# Altium schematic sheet Sheet1.SchDoc
size A; SheetNumber: 1; SheetTotal: 1
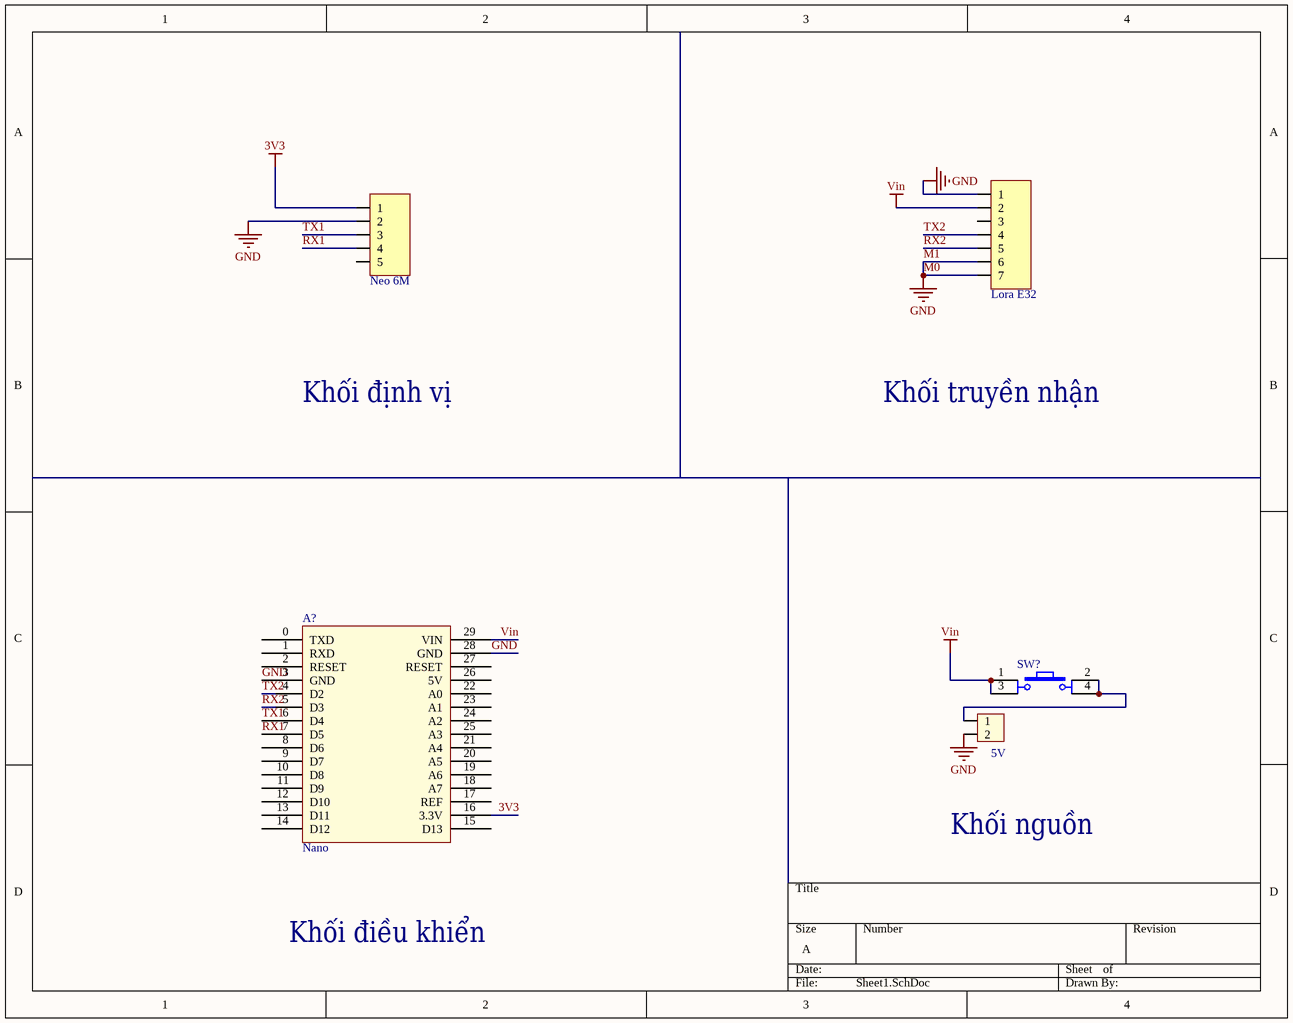
[diagram p0: Sheet1.SchDoc]

## Parts
(Parts that share a designator on the sheet are numbered #1, #2 ... from top to bottom, then left to right.)
5V  Header 2P 2.54 Duc Thang  [XH2.54M-2]  (value not drawn)
A?  Nano  [Arduino nano]
JP?#1  Lora E32  [JP 1x7 CT]
JP?#2  Neo 6M  [JP 1x5 CT]
SW?  INI PUSH BUTTON SWITCH 4-PIN  [SW_70_31.5D47_TH_ST]  (value not drawn)

## Nets
3V3: A?.16(3.3V) JP?#2.1
GND: 5V.2 A?.3(GND) A?.28(GND) JP?#1.1 JP?#1.6 JP?#1.7 JP?#2.2  [also labelled M0, M1]
Vin: A?.29(VIN) JP?#1.2 SW?.1 SW?.3
RX1: A?.7(D5) JP?#2.4
RX2: A?.5(D3) JP?#1.5
TX1: A?.6(D4) JP?#2.3
TX2: A?.4(D2) JP?#1.4
Net5V_1: 5V.1 SW?.2 SW?.4

Not connected (* = marked no-connect by the designer): A? 0(TXD) 1(RXD) 2(RESET) 8(D6) 9(D7) 10(D8) 11(D9) 12(D10) 13(D11) 14(D12) 15(D13) 17(REF) 18(A7) 19(A6) 20(A5) 21(A4) 22(A0) 23(A1) 24(A2) 25(A3) 26(5V) 27(RESET); JP?#1 3; JP?#2 5

## Notes on the sheet
- Khối định vị
- Khối truyền nhận
- Khối nguồn
- Khối điều khiển

## Library data of the parts
5V = Header 2P 2.54 Duc Thang: Cắm; Ten_Linh_Kien: Header 2P XH2.54-2P Đực Thẳng; Don_Vi: Con; Ma_Hang: MH001283; Chung_Loai: Cắm
A? = Arduino Nano
JP?#1 = JP 1x7 2.54 Cai Thang: Cắm; Ten_Linh_Kien: Jump Đơn Cái 2.54MM 1x20P Thẳng; Don_Vi: Con; Ma_Hang: MH004006; Ghi_Chu: *; Kieu_Chan: *; Chung_Loai: Cắm
JP?#2 = JP 1x5 2.54 Cai Thang: Cắm; Ten_Linh_Kien: Jump Đơn Cái 2.54MM 1x20P Thẳng; Don_Vi: Con; Ma_Hang: MH004006; Ghi_Chu: *; Kieu_Chan: *; Chung_Loai: Cắm
SW? = SW2_BUTT-4-TH: Tactile Switches MINI PUSH BUTTON SWITCH 4-PIN QTY. 4; Manufacturer: Gravitech; Manufacturer Part Number: BUTT-4; Alternate Part Number-1: NA; Case/Package: TH; Supplier-1: SP ROAD; Supplier Part Number-1: BUTT-4